# EAGLE design Skaarhoj BI8-SE-C30 (EAGLE 6.2)
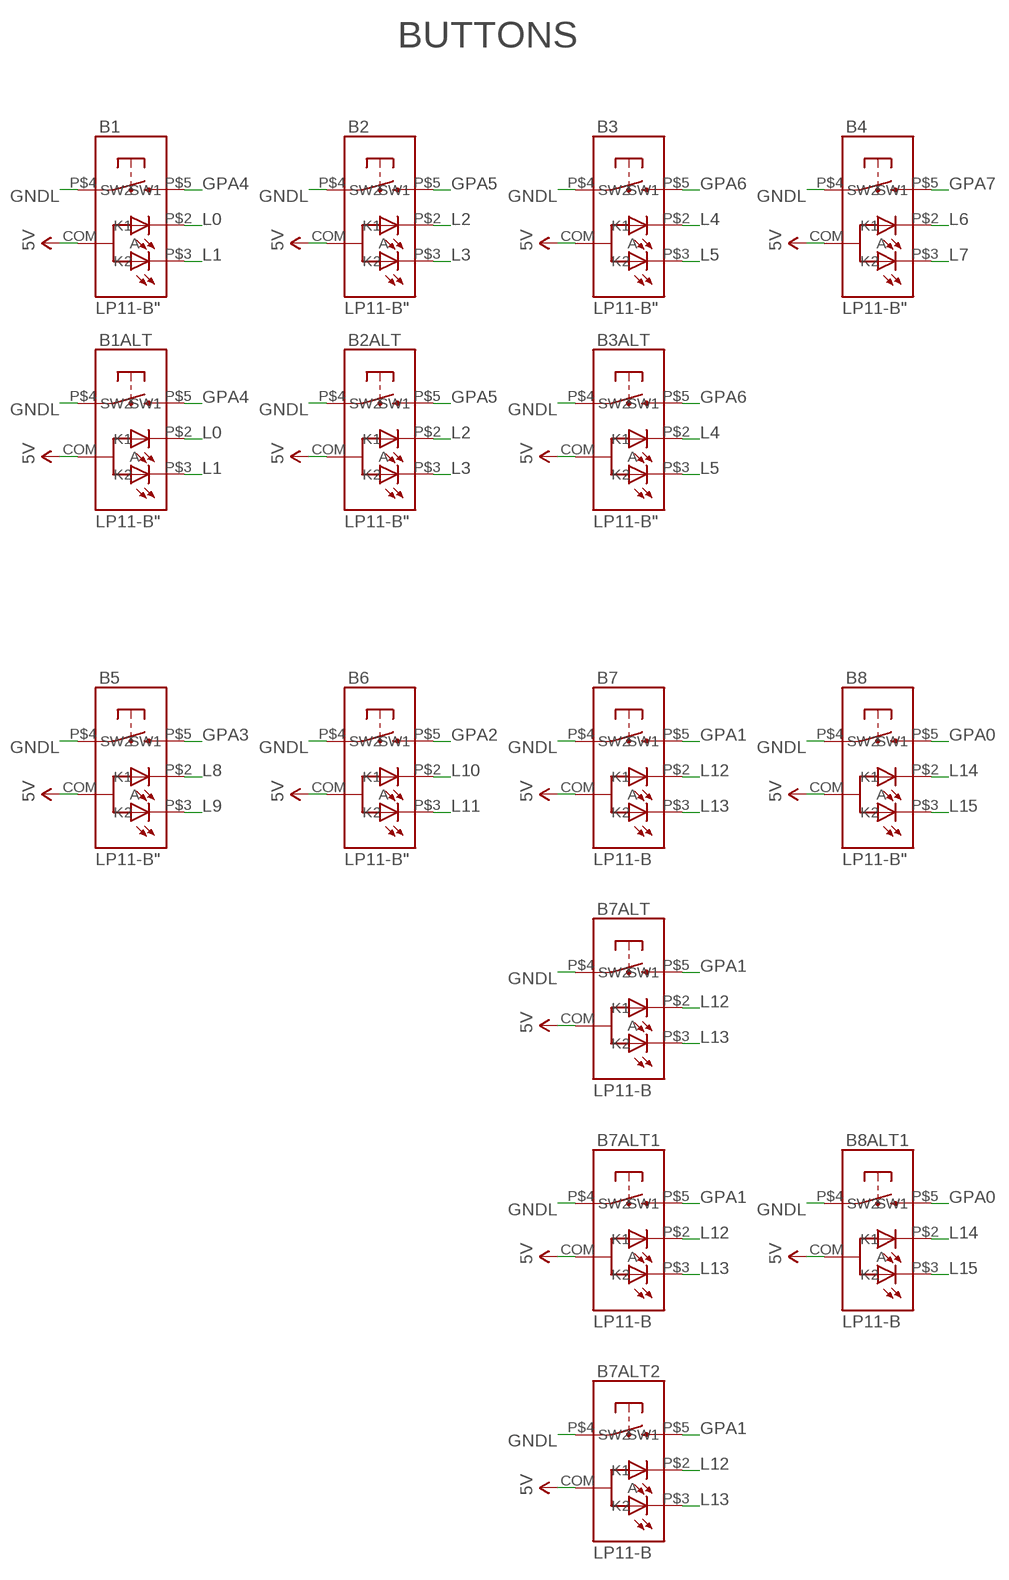
[diagram p0: schematic, sheet 1, part 1 of 2]
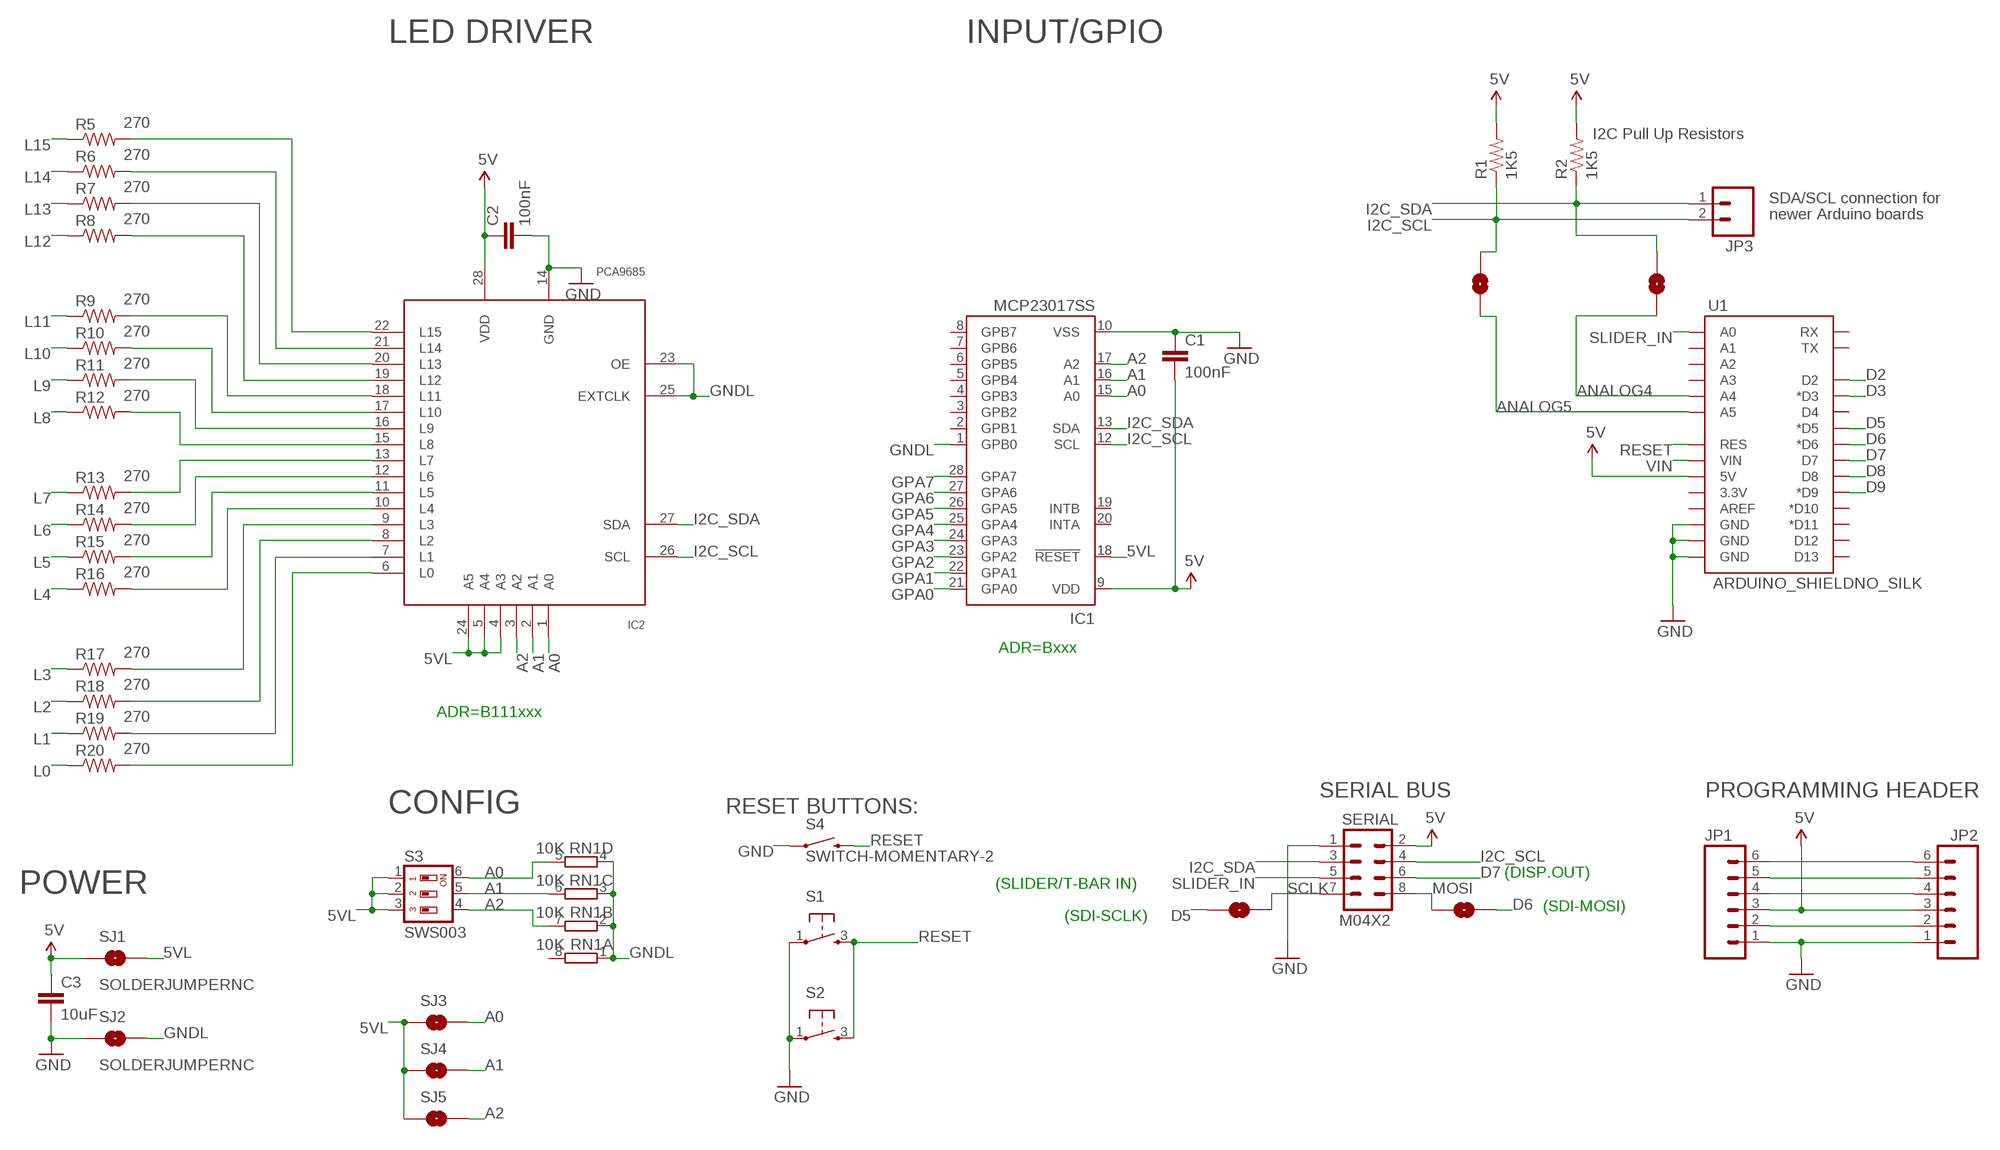
[diagram p1: schematic, sheet 1, part 2 of 2]

## Parts
B1  LP11-B"  [LP11]
B1ALT  LP11-B"  [LP11]
B2  LP11-B"  [LP11]
B2ALT  LP11-B"  [LP11]
B3  LP11-B"  [LP11]
B3ALT  LP11-B"  [LP11]
B4  LP11-B"  [LP11]
B5  LP11-B"  [LP11]
B6  LP11-B"  [LP11]
B7  LP11-B  [LP11_NOFIXHOLES]
B7ALT  LP11-B  [LP11_NOFIXHOLES]
B7ALT1  LP11-B  [LP11_NOFIXHOLES]
B7ALT2  LP11-B  [LP11_NOFIXHOLES]
B8  LP11-B"  [LP11]
B8ALT1  LP11-B  [LP11_NOFIXHOLES]
C1  100nF  CAP0603-CAP  [0603-CAP]
C2  100nF  CAP0603-CAP  [0603-CAP]
C3  10uF  CAP0805  [0805]
IC1  MCP23017SS  [SSOP28]
IC2  PCA9685  [TSSOP28]
JP1  M06POLAR  [MOLEX-1X6]
JP2  M06POLAR  [MOLEX-1X6]
JP3  M02PTH  [1X02]
MOSI->D6  SOLDERJUMPERNC  [SJ_2S]
R1  1K5  RESISTOR0603-RES  [0603-RES]
R2  1K5  RESISTOR0603-RES  [0603-RES]
R5  270  RESISTOR0603-RES  [0603-RES]
R6  270  RESISTOR0603-RES  [0603-RES]
R7  270  RESISTOR0603-RES  [0603-RES]
R8  270  RESISTOR0603-RES  [0603-RES]
R9  270  RESISTOR0603-RES  [0603-RES]
R10  270  RESISTOR0603-RES  [0603-RES]
R11  270  RESISTOR0603-RES  [0603-RES]
R12  270  RESISTOR0603-RES  [0603-RES]
R13  270  RESISTOR0603-RES  [0603-RES]
R14  270  RESISTOR0603-RES  [0603-RES]
R15  270  RESISTOR0603-RES  [0603-RES]
R16  270  RESISTOR0603-RES  [0603-RES]
R17  270  RESISTOR0603-RES  [0603-RES]
R18  270  RESISTOR0603-RES  [0603-RES]
R19  270  RESISTOR0603-RES  [0603-RES]
R20  270  RESISTOR0603-RES  [0603-RES]
RN1  10K  4R-NCAY16  [CAY16_HAND]
S1  TAC_SWITCH  [PUSHBUTTON]
S2  TAC_SWITCH  [PUSHBUTTON]
S3  SWS003  [SMS-003]
S3->A2  SOLDERJUMPERNC  [SJ_2S]
S3->A3  SOLDERJUMPERNC  [SJ_2S]
S4  SWITCH-MOMENTARY-2  [TACTILE_SWITCH_TALL]
SCLK->D5  SOLDERJUMPERNC  [SJ_2S]
SERIAL  M04X2  [2X4]
SJ1  SOLDERJUMPERNC  [SJ_2S]
SJ2  SOLDERJUMPERNC  [SJ_2S]
SJ3  SOLDERJUMPERNC  [SJ_2S]
SJ4  SOLDERJUMPERNC  [SJ_2S]
SJ5  SOLDERJUMPERNC  [SJ_2S]
U1  ARDUINO_SHIELDNO_SILK  [DUEMILANOVE_VIAS]

## Nets
5V [Power]: B1.COM(A) B1ALT.COM(A) B2.COM(A) B2ALT.COM(A) B3.COM(A) B3ALT.COM(A) B4.COM(A) B5.COM(A) B6.COM(A) B7.COM(A) B7ALT1.COM(A) B7ALT2.COM(A) B7ALT.COM(A) B8.COM(A) B8ALT1.COM(A) C1.2 C2.1 C3.1 IC1.9(VDD) IC2.28(VDD) JP1.3 JP2.3 R1.2 R2.2 SERIAL.2 SJ1.1 U1.5V
5VL: IC1.18(!RESET) IC2.4(A3) IC2.5(A4) IC2.24(A5) S3.1 S3.2 S3.3 SJ1.2 SJ3.1 SJ4.1 SJ5.1
A0: IC1.15(A0) IC2.1(A0) RN1.5 S3.6 SJ3.2
A1: IC1.16(A1) IC2.2(A1) RN1.6 S3.5 SJ4.2
A2: IC1.17(A2) IC2.3(A2) RN1.7 S3.4 SJ5.2
ANALOG4: S3->A3.2 U1.A4
ANALOG5: S3->A2.2 U1.A5
D2: U1.D2
D3: U1.D3(*D3)
D5: SCLK->D5.1 U1.D5(*D5)
D6: MOSI->D6.2 U1.D6(*D6)
D7: SERIAL.6 U1.D7
D8: U1.D8
D9: U1.D9(*D9)
GND [Power]: C1.1 C2.2 C3.2 IC1.10(VSS) IC2.14(GND) JP1.1 JP2.1 S1.1 S2.1 S4.A2 SERIAL.1 SJ2.1 U1.GND@0(GND) U1.GND@1(GND) U1.GND@2(GND)
GNDL: B1.P$4(SW1) B1ALT.P$4(SW1) B2.P$4(SW1) B2ALT.P$4(SW1) B3.P$4(SW1) B3ALT.P$4(SW1) B4.P$4(SW1) B5.P$4(SW1) B6.P$4(SW1) B7.P$4(SW1) B7ALT1.P$4(SW1) B7ALT2.P$4(SW1) B7ALT.P$4(SW1) B8.P$4(SW1) B8ALT1.P$4(SW1) IC1.1(GPB0) IC2.23(OE) IC2.25(EXTCLK) RN1.1 RN1.2 RN1.3 RN1.4 SJ2.2
GPA0: B8.P$5(SW2) B8ALT1.P$5(SW2) IC1.21(GPA0)
GPA1: B7.P$5(SW2) B7ALT1.P$5(SW2) B7ALT2.P$5(SW2) B7ALT.P$5(SW2) IC1.22(GPA1)
GPA2: B6.P$5(SW2) IC1.23(GPA2)
GPA3: B5.P$5(SW2) IC1.24(GPA3)
GPA4: B1.P$5(SW2) B1ALT.P$5(SW2) IC1.25(GPA4)
GPA5: B2.P$5(SW2) B2ALT.P$5(SW2) IC1.26(GPA5)
GPA6: B3.P$5(SW2) B3ALT.P$5(SW2) IC1.27(GPA6)
GPA7: B4.P$5(SW2) IC1.28(GPA7)
I2C_SCL: IC1.12(SCL) IC2.26(SCL) JP3.2 R1.1 S3->A2.1 SERIAL.4
I2C_SDA: IC1.13(SDA) IC2.27(SDA) JP3.1 R2.1 S3->A3.1 SERIAL.3
L0: B1.P$2(K1) B1ALT.P$2(K1) R20.1
L1: B1.P$3(K2) B1ALT.P$3(K2) R19.1
L2: B2.P$2(K1) B2ALT.P$2(K1) R18.1
L3: B2.P$3(K2) B2ALT.P$3(K2) R17.1
L4: B3.P$2(K1) B3ALT.P$2(K1) R16.1
L5: B3.P$3(K2) B3ALT.P$3(K2) R15.1
L6: B4.P$2(K1) R14.1
L7: B4.P$3(K2) R13.1
L8: B5.P$2(K1) R12.1
L9: B5.P$3(K2) R11.1
L10: B6.P$2(K1) R10.1
L11: B6.P$3(K2) R9.1
L12: B7.P$2(K1) B7ALT1.P$2(K1) B7ALT2.P$2(K1) B7ALT.P$2(K1) R8.1
L13: B7.P$3(K2) B7ALT1.P$3(K2) B7ALT2.P$3(K2) B7ALT.P$3(K2) R7.1
L14: B8.P$2(K1) B8ALT1.P$2(K1) R6.1
L15: B8.P$3(K2) B8ALT1.P$3(K2) R5.1
MOSI: MOSI->D6.1 SERIAL.8
N$1: JP1.2 JP2.2
N$4: IC2.13(L7) R13.2
N$5: IC2.12(L6) R14.2
N$7: IC2.11(L5) R15.2
N$9: IC2.10(L4) R16.2
N$10: IC2.9(L3) R17.2
N$11: IC2.8(L2) R18.2
N$12: IC2.7(L1) R19.2
N$19: IC2.6(L0) R20.2
N$20: IC2.15(L8) R12.2
N$21: IC2.16(L9) R11.2
N$22: IC2.17(L10) R10.2
N$23: IC2.18(L11) R9.2
N$24: IC2.19(L12) R8.2
N$25: IC2.20(L13) R7.2
N$26: IC2.21(L14) R6.2
N$27: IC2.22(L15) R5.2
N$33: JP1.4 JP2.4
N$34: JP1.5 JP2.5
N$45: JP1.6 JP2.6
RESET: S1.3 S2.3 S4.B2 U1.RES
SCLK: SCLK->D5.2 SERIAL.7
SLIDER_IN: SERIAL.5 U1.A0
VIN [Power]: U1.VIN
Unconnected: IC1.2(GPB1) IC1.3(GPB2) IC1.4(GPB3) IC1.5(GPB4) IC1.6(GPB5) IC1.7(GPB6) IC1.8(GPB7) IC1.19(INTB) IC1.20(INTA) RN1.8 U1.3.3V U1.A1 U1.A2 U1.A3 U1.AREF U1.D4 U1.D10(*D10) U1.D11(*D11) U1.D12 U1.D13 U1.RX U1.TX

## Notes on the sheet
- BUTTONS | LED DRIVER | INPUT/GPIO
- I2C Pull Up Resistors
- SDA/SCL connection for
- newer Arduino boards
- ADR=Bxxx
- ADR=B111xxx
- SERIAL BUS | PROGRAMMING HEADER
- CONFIG | RESET BUTTONS:
- (DISP.OUT)
- (SLIDER/T-BAR IN)
- POWER
- (SDI-MOSI)
- (SDI-SCLK)

## Library data of the parts
B1 B1ALT B2 B2ALT B3 B3ALT B4-B7 B7ALT B7ALT1 B7ALT2 B8 B8ALT1 = SKAARHOJ:LP11-B
C1-C3 = SparkFun:CAP: Capacitor Standard 0603 ceramic capacitor, and 0.1" leaded capacitor.
IC1 = microchip:MCP23017: http://ww1.microchip.com/downloads/en/DeviceDoc/21952a.pdf Source: http://ww1.microchip.com/downloads/en/DeviceDoc/21952a.pdf; MF: MICROCHIP; MPN: MCP23017-E/SS; OC_FARNELL: 1467674; OC_NEWARK: 31K2960
IC2 = wsmith:PCA9685
JP1 JP2 = SparkFun:M06: Header 6 Standard 6-pin 0.1" header. Use with straight break away headers (SKU : PRT-00116), right angle break away headers (PRT-00553), swiss pins (PRT-00743), machine pins (PRT-00117), and female headers (PRT-00115). Molex polarized connector foot print use with SKU : PRT-08094 with associated crimp pins and housings. NOTES ON THE VARIANTS LOCK and LOCK_LONGPADS... This footprint was designed to help hold the alignment of a through-hole component (i.e. 6-pin header) while soldering it into place. You may notice that each hole has been shifted either up or down by 0.005 of an inch from it's more standard position (which is a perfectly straight line). This slight alteration caused the pins (the squares in the middle) to touch the edges of the holes. Because they are alternating, it causes a "brace" to hold the component in place. 0.005 has proven to be the perfect amount of "off-center" position when using our standard breakaway headers. Although looks a little odd when you look at the bare footprint, once you have a header in there, the alteration is very hard to notice. Also, if you push a header all the way into place, it is covered up entirely on the bottom side. This idea of altering the position of holes to aid alignment will be further integrated into the Sparkfun Library for other footprints. It can help hold any component with 3 or more connection pins.
JP3 = SparkFun:M02: Header 2 Standard 2-pin 0.1" header. Use with straight break away headers (SKU : PRT-00116), right angle break away headers (PRT-00553), swiss pins (PRT-00743), machine pins (PRT-00117), and female headers (PRT-00115). Molex polarized connector foot print use with SKU : PRT-08233 with associated crimp pins and housings.
MOSI->D6 S3->A2 S3->A3 SCLK->D5 SJ1-SJ5 = SparkFun:SOLDERJUMPER: Solder Jumper Standard SMD solder jumper. Used to automate production. Two varients : Normally Open and Normally Closed are the same, but have different paste layers. NC will have a large amount of paste and should jumper during reflow.
R1 R2 R5-R20 = SparkFun:RESISTOR: Resistor Basic schematic elements and footprints for 0603, 1206, and PTH resistors.
RN1 = SKAARHOJ:4R-N: Array Chip Resistor Source: RS Component / Phycomp; OC_FARNELL: unknown; OC_NEWARK: unknown
S1 S2 = SKAARHOJ:TAC_SWITCH: Momentary Switch Button commonly used for reset or general input. Spark Fun Electronics SKU : COM-00097
S3 = smd-special:SWS003: SMD Dip Switch 3 pol.
S4 = SparkFun:SWITCH-MOMENTARY-2
SERIAL = SparkFun:M04X2
U1 = SparkFun:ARDUINO_SHIELD

## Net classes
0 default: width 0.203 mm, drill 0.406 mm, clearance 0.203 mm
1 Power: width 0.406 mm, drill 0.61 mm, clearance 0.203 mm

## Board
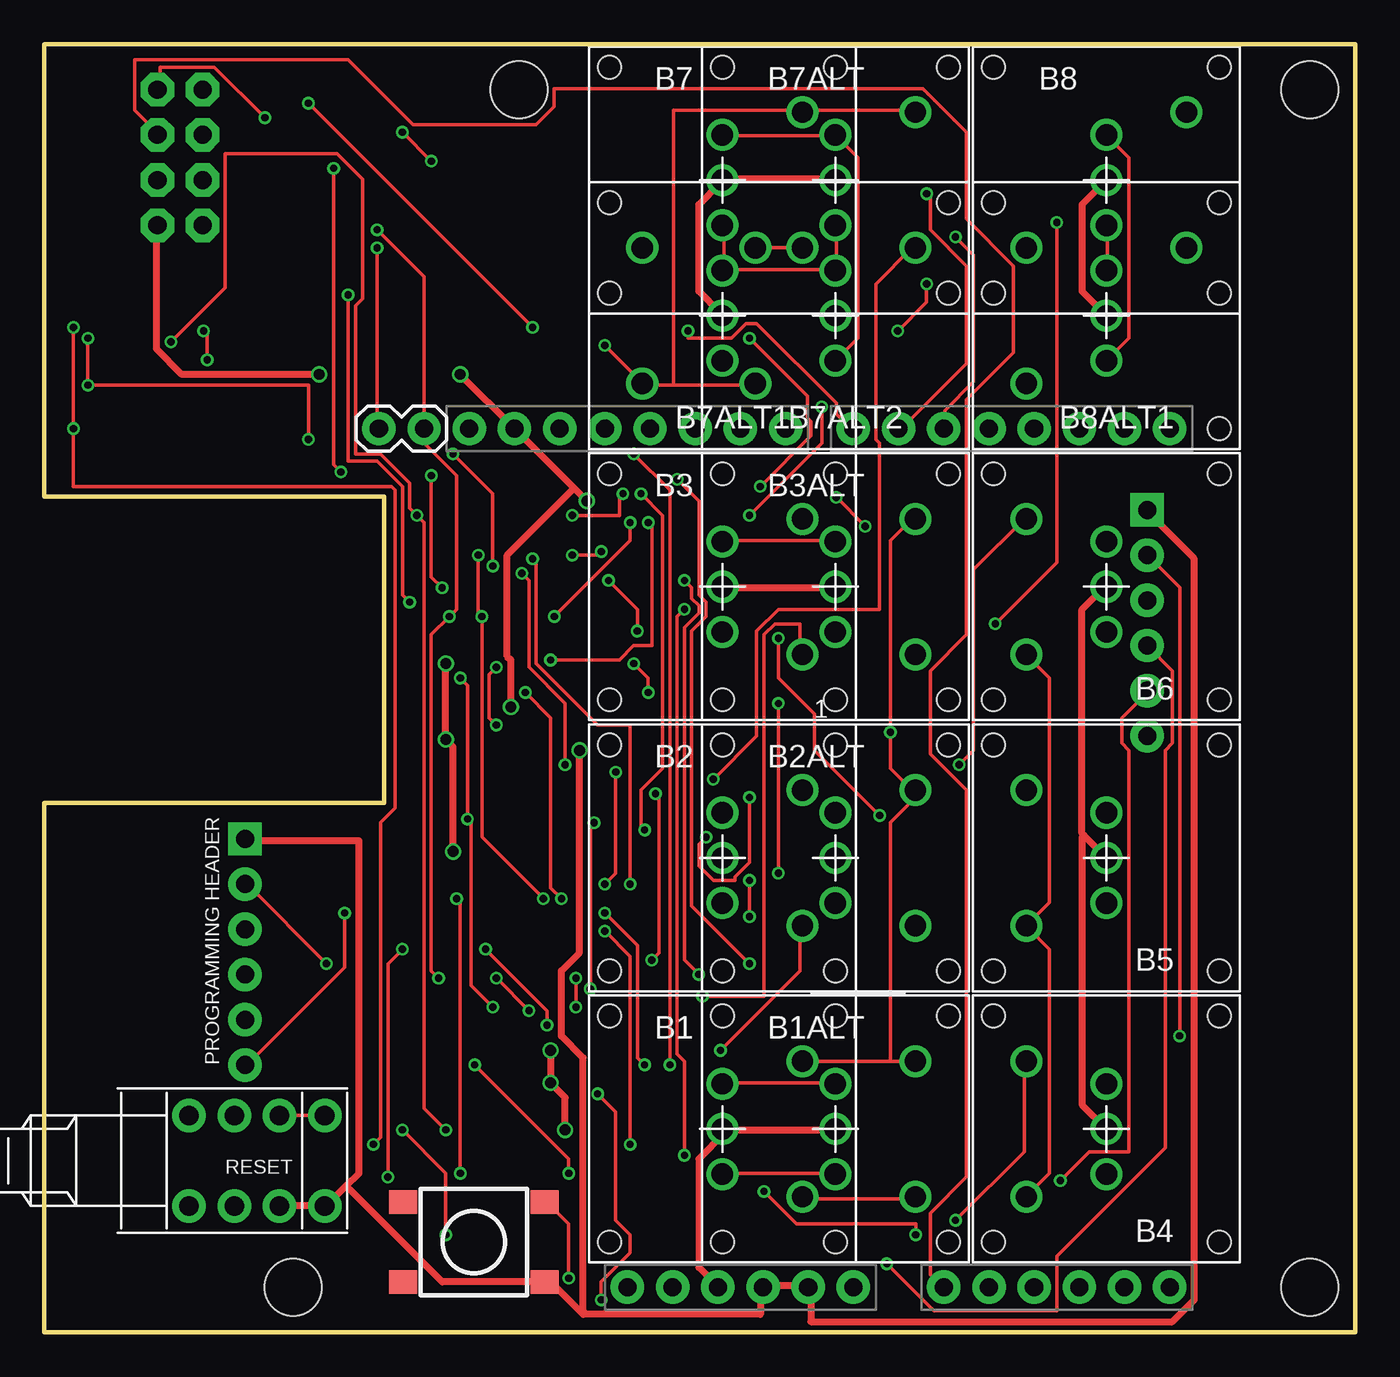
[diagram p2: board, top side]
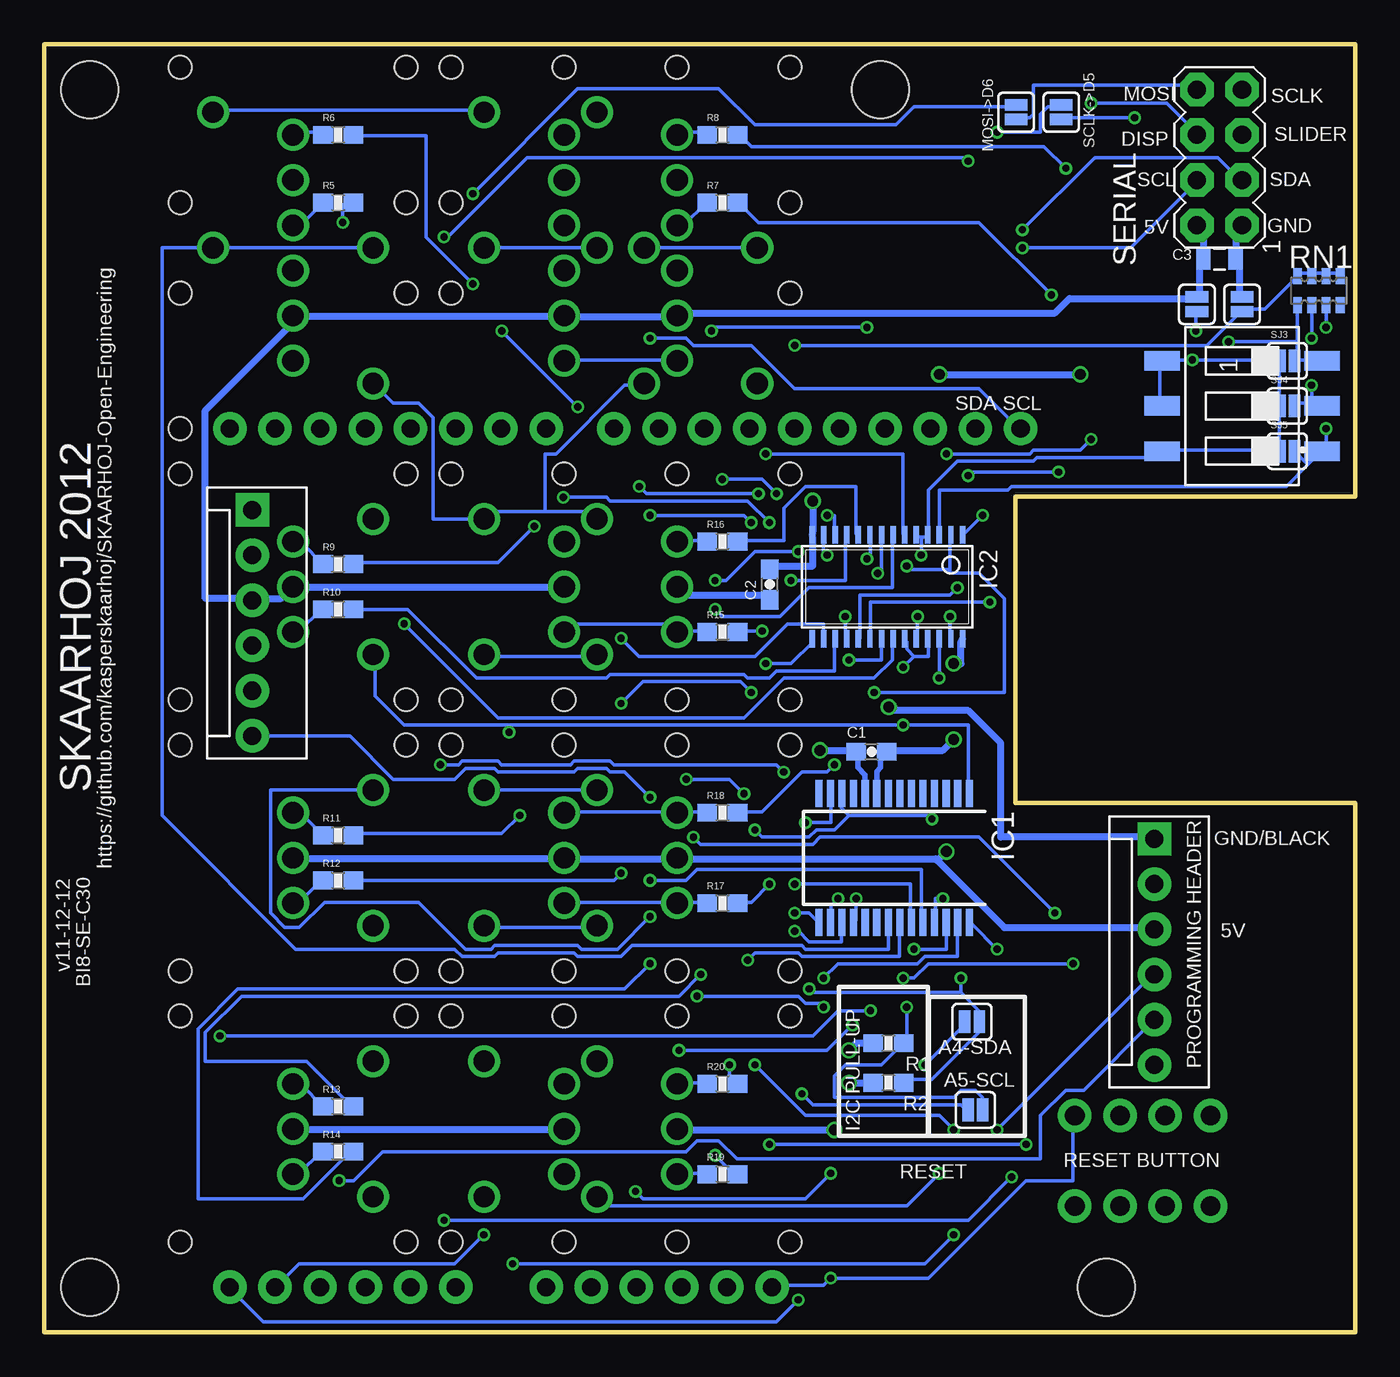
[diagram p3: board, bottom side, seen from below]

Size 73.66 x 72.39 mm. Coordinates in mm from the lower left corner, seen from the top.
Outline: 0,46.99 19.1,46.99 19.1,29.77 0,29.77 0,0 73.66,0 73.66,72.39 0,72.39 0,46.99
Copper layers (1*16): Top 0.035mm / dielectric 1.5mm / Bottom 0.035mm
Design rules: minimum track width 6mil, minimum drill 12mil, track to track 6mil, track to pad 6mil, pad to pad 6mil, via to via 6mil, smd to smd 0mil, copper to edge 10mil, drill to drill 10mil, minimum pad ring 10mil, minimum via ring 6mil, stop-mask expansion 2mil, vias tented up to drill 100mil, thermal gap 10mil
Holes 3.2 mm at 13.97,2.54 71.12,2.54 71.12,69.85 26.67,69.85
Holes 1.3 mm at 53.34,63.5 66.04,63.5 66.04,50.8 31.75,71.12 31.75,58.42 31.75,63.5 50.8,63.5 50.8,58.42 50.8,71.12 44.45,71.12 38.1,71.12
tRestrict: area 0,29.6 to 19.6,47.2
bRestrict: area 0,29.6 to 19.6,47.2

### Footprints (pad centres in the part's own frame; a part is rotated, then mirrored left to right if it is on the bottom)
LP11 = drill 1.2: COM 0,0; P$2 0,2.54; P$3 0,-2.54; P$4 4.5,3.81; P$5 4.5,-3.81 | hole 1.3: -6.35,6.35; 6.35,6.35; 6.35,-6.35; -6.35,-6.35
LP11_NOFIXHOLES = drill 1.2: COM 0,0; P$2 0,2.54; P$3 0,-2.54; P$4 4.5,3.81; P$5 4.5,-3.81
0603-CAP = smd 1.1 x 1: 1 -0.85,0; 2 0.85,0
0805 = smd 0.8 x 1.2: 1 -0.9,0; 2 0.9,0
SSOP28 = smd 0.4 x 1.5: 1 -4.225,-3.625; 2 -3.575,-3.625; 3 -2.925,-3.625; 4 -2.275,-3.625; 5 -1.625,-3.625; 6 -0.975,-3.625; 7 -0.325,-3.625; 8 0.325,-3.625; 9 0.975,-3.625; 10 1.625,-3.625; 11 2.275,-3.625; 12 2.925,-3.625; 13 3.575,-3.625; 14 4.225,-3.625; 15 4.225,3.625; 16 3.575,3.625; 17 2.925,3.625; 18 2.275,3.625; 19 1.625,3.625; 20 0.975,3.625; 21 0.325,3.625; 22 -0.325,3.625; 23 -0.975,3.625; 24 -1.625,3.625; 25 -2.275,3.625; 26 -2.925,3.625; 27 -3.575,3.625; 28 -4.225,3.625
TSSOP28 = smd 0.305 x 0.991: 1 -4.225,-2.918; 2 -3.575,-2.918; 3 -2.925,-2.918; 4 -2.275,-2.918; 5 -1.625,-2.918; 6 -0.975,-2.918; 7 -0.325,-2.918; 8 0.325,-2.918; 9 0.975,-2.918; 10 1.625,-2.918; 11 2.275,-2.918; 12 2.925,-2.918; 13 3.575,-2.918; 14 4.225,-2.918; 15 4.225,2.918; 16 3.575,2.918; 17 2.925,2.918; 18 2.275,2.918; 19 1.625,2.918; 20 0.975,2.918; 21 0.325,2.918; 22 -0.325,2.918; 23 -0.975,2.918; 24 -1.625,2.918; 25 -2.275,2.918; 26 -2.925,2.918; 27 -3.575,2.918; 28 -4.225,2.918
MOLEX-1X6 = drill 1.016 pad 1.88 square: 1 0,0 | drill 1.016 pad 1.88: 2 2.54,0; 3 5.08,0; 4 7.62,0; 5 10.16,0; 6 12.7,0
1X02 = drill 1.016 pad 1.88: 1 0,0; 2 2.54,0
SJ_2S = smd 0.635 x 1.27: 1 -0.412,0; 2 0.412,0
0603-RES = smd 1.1 x 1: 1 -0.85,0; 2 0.85,0
CAY16_HAND = smd 0.5 x 0.904: 1 -1.2,-0.813; 2 -0.4,-0.813; 3 0.4,-0.813; 4 1.2,-0.813; 5 1.2,0.813; 6 0.4,0.813; 7 -0.4,0.813; 8 -1.2,0.813
PUSHBUTTON = drill 1.1 pad 1.88: 1 2.54,2.54; 2 2.54,-2.54; 3 -2.54,2.54; 4 -2.54,-2.54
SMS-003 = smd 1.092 x 2.007: 1 -2.54,-4.496; 2 0,-4.496; 3 2.54,-4.496; 4 2.54,4.496; 5 0,4.496; 6 -2.54,4.496
TACTILE_SWITCH_TALL = smd 1.55 x 1.3: A1 -3.975,-2.25; A2 3.975,-2.25; B1 -3.975,2.25; B2 3.975,2.25
2X4 = drill 1.016 pad 1.88 octagon: 1 -3.81,-1.27; 2 -3.81,1.27; 3 -1.27,-1.27; 4 -1.27,1.27; 5 1.27,-1.27; 6 1.27,1.27; 7 3.81,-1.27; 8 3.81,1.27
DUEMILANOVE_VIAS = drill 1.016 pad 1.88: 3.3V 50.8,13.97; 5V 50.8,16.51; A0 50.8,29.21; A1 50.8,31.75; A2 50.8,34.29; A3 50.8,36.83; A4 50.8,39.37; A5 50.8,41.91; AREF 2.54,2.54; D2 2.54,36.83; D3 2.54,34.29; D4 2.54,31.75; D5 2.54,29.21; D6 2.54,26.67; D7 2.54,24.13; D8 2.54,20.32; D9 2.54,17.78; D10 2.54,15.24; D11 2.54,12.7; D12 2.54,10.16; D13 2.54,7.62; GND@0 50.8,19.05; GND@1 50.8,21.59; GND@2 2.54,5.08; RES 50.8,11.43; RX 2.54,41.91; TX 2.54,39.37; VIN 50.8,24.13

### Placement (x,y rotation side)
B1  38.1,11.43 0 top
B1ALT  44.45,11.43 0 top
B2  38.1,26.67 0 top
B2ALT  44.45,26.67 0 top
B3  38.1,41.91 0 top
B3ALT  44.45,41.91 0 top
B4  59.69,11.43 180 top
B5  59.69,26.67 180 top
B6  59.69,41.91 180 top
B7  38.1,64.77 0 top
B7ALT  44.45,64.77 0 top
B7ALT1  38.1,57.15 180 top
B7ALT2  44.45,57.15 180 top
B8  59.69,64.77 0 top
B8ALT1  59.69,57.15 180 top
C1  27.18,32.64 0 bottom
C2  32.89,42.04 90 bottom
C3  7.62,60.33 0 bottom
IC1  25.91,26.67 180 bottom
IC2  26.29,41.91 180 bottom
JP1  61.98,46.23 270 bottom
JP2  11.27,27.74 270 bottom
JP3  21.34,50.8 180 top
MOSI->D6  19.05,68.58 90 bottom
R1  26.23,16.26 180 bottom
R2  26.23,14.03 180 bottom
R5  57.15,63.5 0 bottom
R6  57.15,67.31 0 bottom
R7  35.56,63.5 0 bottom
R8  35.56,67.31 0 bottom
R9  57.15,43.18 0 bottom
R10  57.15,40.64 0 bottom
R11  57.15,27.94 0 bottom
R12  57.15,25.4 0 bottom
R13  57.15,12.7 0 bottom
R14  57.15,10.16 0 bottom
R15  35.56,39.37 0 bottom
R16  35.56,44.45 0 bottom
R17  35.56,24.13 0 bottom
R18  35.56,29.21 0 bottom
R19  35.56,8.89 0 bottom
R20  35.56,13.97 0 bottom
RN1  2.03,58.55 180 bottom
S1  13.21,9.65 270 top
S2  10.67,9.65 270 top
S3  6.35,52.07 270 bottom
S3->A2  21.34,12.51 180 bottom
S3->A3  21.53,17.46 180 bottom
S4  24.13,5.08 0 top
SCLK->D5  16.51,68.58 270 bottom
SERIAL  7.62,66.04 90 bottom
SJ1  8.89,57.78 270 bottom
SJ2  6.35,57.78 270 bottom
SJ3  3.81,54.61 0 bottom
SJ4  3.81,52.07 0 bottom
SJ5  3.81,49.53 0 bottom
U1  21.34,53.34 270 top

### Tracks (layer width: path | path; a pad name or v marks a point on that pad's centre or on a via)
5V  (via drill 0.61)
  Top 0.406: B8ALT1.COM 58.32,58.52 58.32,63.4 B8.COM | B7ALT.COM 44.3,64.82 38.2,64.82 B7.COM 38,64.62 36.78,63.4 36.78,58.52 38,57.3 B7ALT1.COM | v28.45,15.85 v28.45,14.02 29.26,13.21 v29.26,11.38 | B1ALT.COM 44.3,11.38 38.2,11.38 B1.COM 38.2,11.18 36.78,9.75 36.78,3.66 37.8,2.64 U1.5V | B3ALT.COM 44.3,41.86 38.2,41.86 B3.COM | v22.55,37.59 v22.55,33.33 22.96,32.92 v22.96,27.03 | B5.COM 58.42,27.94 | 58.42,27.94 58.32,28.04 58.32,40.64 59.54,41.86 B6.COM | B4.COM 58.32,12.8 58.32,27.84 58.42,27.94
  Bottom 0.305: IC1.9 26.88,31.54 26.67,31.75 26.67,32.3 C1.2
  Bottom 0.406: SERIAL.2 8.74,62.18 8.53,62.18 8.53,60.35 C3.1 8.53,60.15 8.74,60.15 8.74,58.32 SJ1.1 8.94,58.12 16.05,58.12 16.87,57.3 38,57.3 B7ALT1.COM 38.2,57.1 44.3,57.1 B7ALT2.COM 44.5,57.1 59.54,57.1 B8ALT1.COM 59.54,56.9 64.62,51.82 64.62,41.25 61.98,41.25 | v28.45,14.02 27.23,14.02 R2.2 | v28.45,15.85 28.04,16.26 R1.2 | v29.26,11.38 38,11.38 B1.COM | B4.COM 59.54,11.38 44.5,11.38 B1ALT.COM | 61.98,41.25 60.35,41.25 B6.COM 59.54,41.86 44.5,41.86 B3ALT.COM | C2.1 32.92,41.25 33.12,41.45 37.59,41.45 38,41.86 B3.COM | v22.55,37.59 22.15,37.59 22.15,38.81 IC2.28 | v22.55,33.33 23.16,32.72 26.21,32.72 C1.2 | B5.COM 59.54,26.62 44.5,26.62 B2ALT.COM 44.3,26.62 38.2,26.62 B2.COM 38,26.62 23.57,26.62 23.47,26.52 | 23.47,26.52 19.71,22.76 11.38,22.76 JP2.3 | 23.47,26.52 v22.96,27.03 | 61.98,41.25 JP1.3
5VL  (via drill 0.41)
  Top 0.203: v8.94,56.29 9.14,56.08 v9.14,54.66 | v24.38,43.69 24.38,40.44 v24.59,40.23 24.59,27.84 v28.04,24.38
  Bottom 0.203: v8.94,56.29 8.94,57.3 SJ1.2 | S3.2 10.97,52.22 10.97,54.46 S3.1 10.77,54.66 v9.14,54.66 4.27,54.66 SJ3.1 4.27,54.46 4.27,52.22 SJ4.1 4.27,52.02 4.27,49.58 | 4.27,49.58 10.77,49.58 S3.3 10.97,49.38 11.18,49.17 17.88,49.17 18.09,48.97 22.35,48.97 23.98,47.35 23.98,44.91 IC2.4 23.98,44.7 24.38,44.7 | 4.27,49.58 SJ5.1 | v24.59,40.23 24.59,39.01 IC2.24 | 24.38,44.7 v24.38,43.69 | 24.38,44.7 24.59,44.7 IC2.5 | v28.04,24.38 28.04,23.16 IC1.18
A0  (via drill 0.41)
  Top 0.203: v7.11,55.68 10.16,58.73 10.16,66.24 16.46,66.24 17.88,64.82 17.88,58.12 17.48,57.71 17.48,49.38 18.9,49.38 20.52,47.75 20.52,46.33 v20.93,45.92 21.34,45.52 21.34,12.6 v22.55,11.38 | v31.5,23.57 33.33,21.74 33.33,15.44 v33.73,15.04
  Bottom 0.203: 3.25,54.66 3.25,55.68 | 3.25,55.68 3.25,57.71 RN1.5 | v20.93,45.92 21.95,44.91 IC2.1 | 3.25,55.68 v7.11,55.68 | v31.5,23.57 30.68,23.57 30.28,23.16 IC1.15 | v33.73,15.04 30.89,12.19 23.37,12.19 v22.55,11.38 | 3.25,54.66 2.03,54.66 S3.6 | 3.25,54.66 SJ3.2
A1  (via drill 0.41)
  Top 0.203: v2.44,55.88 v2.44,53.24 14.83,53.24 v14.83,50.19 | v27.03,35.97 28.45,34.54 28.45,24.99 v29.06,24.38 | v22.96,49.38 25.2,47.14 v25.2,43.08
  Bottom 0.203: v2.44,55.88 2.44,57.71 RN1.6 | 2.44,52.22 v2.44,53.24 | 2.44,52.22 2.03,52.22 S3.5 2.44,52.22 | 2.44,52.22 3.25,52.22 SJ4.2 | 22.76,42.88 22.76,42.67 21.13,42.67 19.71,41.25 19.71,35.97 v27.03,35.97 | 22.76,42.88 22.76,44.7 IC2.2 | v29.06,24.38 29.46,23.98 29.46,23.16 IC1.16 | v14.83,50.19 15.44,49.58 18.09,49.58 18.29,49.38 v22.96,49.38 | v25.2,43.08 24.99,42.88 22.76,42.88
A2  (via drill 0.41)
  Top 0.203: v1.63,56.49 v1.63,50.8 1.63,47.55 19.51,47.55 19.71,47.35 19.71,29.46 18.9,28.65 18.9,10.97 v18.49,10.57 | v31.5,22.55 32.92,21.13 v32.92,10.57
  Bottom 0.203: v1.63,56.49 1.63,57.71 RN1.7 | v1.63,50.8 1.63,49.58 1.83,49.58 S3.4 2.03,49.38 2.64,48.77 | 2.64,48.77 3.86,47.55 19.3,47.55 19.51,47.35 23.37,47.35 23.37,44.91 IC2.3 | 2.64,48.77 3.25,49.38 SJ5.2 | v31.5,22.55 31.29,22.55 30.68,21.95 28.85,21.95 28.85,22.96 IC1.17 | v18.49,10.57 v32.92,10.57
ANALOG4  (via drill 0.41)
  Top 0.203: v24.18,15.04 29.46,9.75 v29.46,8.94 | v40.44,7.92 42.27,6.1 48.97,6.1 v48.97,5.49
  Bottom 0.203: v24.18,15.04 21.95,17.27 S3->A3.2 | v29.46,8.94 30.89,7.52 40.03,7.52 v40.44,7.92 | v48.97,5.49 50.6,3.86 59.33,3.86 60.55,2.64 U1.A4
ANALOG5  (via drill 0.41)
  Top 0.203: v31.09,13.41 32.11,12.39 32.11,6.3 32.92,5.49 32.92,4.47 31.29,2.85 v31.29,1.83
  Bottom 0.203: v31.09,13.41 30.48,12.8 22.15,12.8 21.95,12.6 S3->A2.2 | v31.29,1.83 32.51,0.61 61.37,0.61 63.2,2.44 U1.A5
D5  (via drill 0.41)
  Top 0.203: v21.74,65.84 v20.12,67.46 | v51.21,61.57 52.22,60.55 52.22,53.44 50.6,51.82 50.6,50.8 U1.D5
  Bottom 0.203: v20.12,67.46 17.68,67.46 17.68,68.48 17.27,68.89 16.66,68.89 SCLK->D5.1 | v21.74,65.84 21.95,66.04 46.53,66.04 51,61.57 v51.21,61.57
D6  (via drill 0.41)
  Top 0.203: v49.58,64.01 49.78,63.8 49.78,61.98 51.82,59.94 51.82,54.46 48.16,50.8 U1.D6
  Bottom 0.203: v49.58,64.01 43.69,69.9 35.76,69.9 33.73,67.87 25.81,67.87 24.79,68.89 19.1,68.89 MOSI->D6.2
D7  (via drill 0.41)
  Top 0.203: v36.17,56.29 36.17,55.88 38.61,55.88 39.42,56.69 40.03,56.69 44.5,52.22 44.5,51.61 45.31,50.8 U1.D7 | v14.83,69.09 v27.43,56.49
  Bottom 0.203: v36.17,56.29 35.97,56.49 v27.43,56.49 | v14.83,69.09 10.57,69.09 8.94,67.46 SERIAL.6
GND  (via drill 0.61)
  Top 0.406: 29.77,47.45 U1.GND@2 v23.37,53.85 | 29.77,47.45 v30.48,46.74 | v15.44,53.85 7.72,53.85 6.3,55.27 6.3,62.18 SERIAL.1 | S2.1 S1.1 15.85,7.11 16.97,8.23 | 16.97,8.23 17.68,8.94 17.68,27.64 11.38,27.64 JP2.1 | 30.18,1.12 30.28,1.02 40.23,1.02 40.23,2.44 U1.GND@0 40.44,2.64 42.88,2.64 U1.GND@1 43.08,2.44 43.08,0.61 63.4,0.61 64.62,1.83 64.62,43.48 61.98,46.13 JP1.1 | 30.18,1.12 28.65,2.64 28.25,2.64 S4.A2 28.04,2.85 22.35,2.85 16.97,8.23 | v30.07,32.72 30.07,21.34 29.06,20.32 29.06,16.66 30.28,15.44 30.28,1.22 30.18,1.12 | 29.77,47.45 26.01,43.69 26.01,38 26.21,37.8 v26.21,35.15
  Bottom 0.305: IC1.10 27.53,31.34 27.94,31.75 27.94,32.55 C1.1
  Bottom 0.406: SERIAL.1 6.5,62.18 6.71,62.18 6.71,60.35 C3.2 6.5,60.35 6.5,58.32 SJ2.1 | 30.48,44.91 IC2.14 | IC2.14 30.48,44.7 30.48,43.08 32.72,43.08 C2.2 | v30.48,46.74 30.48,45.11 IC2.14 | v23.37,53.85 v15.44,53.85 | v30.07,32.72 28.04,32.72 C1.1 | v26.21,35.15 26.01,34.95 21.74,34.95 19.91,33.12 19.91,27.84 11.38,27.84 JP2.1
GNDL  (via drill 0.41)
  Top 0.203: B4.P$4 55.27,7.72 56.49,8.94 56.49,21.54 55.27,22.76 B5.P$4 55.27,22.96 56.49,24.18 56.49,36.78 55.27,38 B6.P$4 | v25.4,37.39 24.99,36.98 24.99,34.54 v25.4,34.14 | B7ALT.P$4 48.77,68.68 42.67,68.68 B7.P$4 42.47,68.68 35.36,68.68 35.36,53.24 | B1ALT.P$4 47.55,15.24 | 47.55,15.24 B1.P$4 | 47.55,15.24 47.55,28.65 48.77,29.87 48.77,30.48 | v31.5,55.47 33.53,53.44 B7ALT1.P$4 33.73,53.24 35.36,53.24 | 35.36,53.24 39.83,53.24 B7ALT2.P$4 | 48.77,30.48 47.55,31.7 v47.55,33.73 47.55,44.5 48.77,45.72 B3ALT.P$4 | 48.77,30.48 B2ALT.P$4
  Bottom 0.203: 24.79,38 23.98,38 23.98,38.81 IC2.25 | 24.79,38 25.2,38.41 25.2,38.81 IC2.23 | 47.55,34.14 53.44,34.14 55.07,35.76 55.07,38 B6.P$4 | 47.55,34.14 v25.4,34.14 21.74,34.14 21.74,30.48 IC1.1 | v25.4,37.39 24.79,38 | B8.P$4 64.01,68.68 48.97,68.68 B7ALT.P$4 | B2ALT.P$4 B2.P$4 | 45.52,46.13 48.36,46.13 48.77,45.72 B3ALT.P$4 51.82,45.72 51.82,51.41 52.63,52.22 54.05,52.22 55.07,53.24 B8ALT1.P$4 | 45.52,46.13 43.08,46.13 42.67,45.72 B3.P$4 | RN1.1 1.02,59.54 1.63,59.54 RN1.2 1.83,59.54 2.23,59.54 RN1.3 2.44,59.54 3.05,59.54 RN1.4 3.25,59.33 5.08,57.51 6.3,57.51 SJ2.2 6.5,57.3 8.33,55.47 v31.5,55.47 | 45.52,46.13 45.52,49.38 44.91,49.38 41.05,53.24 40.03,53.24 B7ALT2.P$4 | v47.55,33.73 47.55,34.14
GPA0
  Bottom 0.203: IC1.21 26.21,22.96 26.21,21.54 30.89,21.54 31.09,21.74 40.64,21.74 41.25,21.13 43.69,21.13 43.89,21.34 48.16,21.34 48.36,21.13 50.19,21.13 50.6,21.54 59.54,21.54 67.06,29.06 67.06,60.96 B8.P$5 B8ALT1.P$5
GPA1  (via drill 0.41)
  Top 0.203: B7ALT2.P$5 B7.P$5 | v34.14,20.93 34.54,21.34 34.54,30.07 v34.34,30.28 | v37.59,31.09 40.03,33.53 40.03,39.42 41.25,40.64 46.94,40.64 46.94,49.99 46.74,50.19 46.74,58.93 48.77,60.96 B7ALT.P$5
  Bottom 0.203: B7ALT2.P$5 B7ALT1.P$5 | v34.14,20.93 33.73,21.34 31.29,21.34 31.09,21.13 25.6,21.13 25.6,22.96 IC1.22 | v34.34,30.28 35.15,31.09 v37.59,31.09 | B7ALT.P$5 B7.P$5
GPA2  (via drill 0.41)
  Top 0.203: v31.5,25.2 32.11,25.81 v32.11,31.5 | v51.41,31.9 52.22,32.72 52.22,42.88 55.07,45.72 B6.P$5
  Bottom 0.203: v31.5,25.2 24.99,25.2 24.99,23.16 IC1.23 | v32.11,31.5 32.51,31.9 41.66,31.9 41.86,32.11 43.89,32.11 44.09,31.9 47.95,31.9 48.16,32.11 50.19,32.11 50.39,31.9 v51.41,31.9
GPA3  (via drill 0.41)
  Top 0.203: v39.62,23.37 v39.62,25.4
  Bottom 0.203: v39.62,25.4 37.59,25.4 36.98,26.01 24.38,26.01 24.38,23.16 IC1.24 | v39.62,23.37 41.45,21.54 43.48,21.54 43.69,21.74 48.36,21.74 48.56,21.54 49.99,21.54 52.63,24.18 57.91,24.18 59.33,22.76 60.15,22.76 60.96,23.57 60.96,30.48 B5.P$5
GPA4  (via drill 0.41)
  Top 0.203: v23.16,24.38 23.37,24.18 v23.37,8.94 | B1ALT.P$5 48.77,7.52 42.67,7.52 B1.P$5
  Bottom 0.203: v23.16,24.38 23.57,24.38 23.57,23.16 IC1.25 | v23.37,8.94 25.2,7.11 42.06,7.11 42.47,7.52 B1.P$5
GPA5  (via drill 0.41)
  Top 0.203: v24.79,21.54 28.25,18.09 v28.25,17.27 | v38,15.85 42.47,20.32 42.47,22.76 B2.P$5
  Bottom 0.203: v24.79,21.54 22.96,21.54 22.96,22.96 IC1.26 | v28.25,17.27 29.67,15.85 v38,15.85 | B2ALT.P$5 48.77,22.76 42.67,22.76 B2.P$5
GPA6  (via drill 0.41)
  Top 0.203: v29.87,18.29 v29.87,19.91 | v36.98,18.9 40.44,18.9 40.44,39.22 41.05,39.83 42.47,39.83 42.47,38.2 B3.P$5
  Bottom 0.203: v29.87,19.91 29.06,20.73 24.59,20.73 24.18,21.13 22.35,21.13 22.35,22.96 IC1.27 | v29.87,18.29 30.07,18.49 30.89,18.49 31.29,18.9 v36.98,18.9 | B3ALT.P$5 48.77,38 42.67,38 B3.P$5
GPA7  (via drill 0.41)
  Top 0.203: v20.12,21.54 19.3,20.73 v19.3,8.74 | v51.21,6.3 55.07,10.16 55.07,15.24 B4.P$5
  Bottom 0.203: v20.12,21.54 21.54,22.96 IC1.28 | v19.3,8.74 21.74,6.3 v51.21,6.3
I2C_SCL  (via drill 0.41)
  Top 0.203: v18.69,60.96 18.69,50.8 JP3.2 | v23.37,36.78 23.77,36.37 v23.77,28.85 23.98,28.65 23.98,19.51 v25.2,18.29 | v39.62,55.88 42.88,52.63 42.88,51.41 43.08,51.21 43.08,50.39 v40.23,47.55 | v33.53,47.14 34.75,45.92 34.75,31.7 33.53,30.48 33.53,28.45 v33.73,28.25
  Bottom 0.203: v18.69,60.96 12.6,60.96 8.94,64.62 SERIAL.4 | S3->A2.1 20.93,12.6 20.93,13.21 21.34,13.61 22.15,13.61 22.55,13.21 29.26,13.21 29.26,14.43 28.65,15.04 26.62,15.04 25.4,16.26 R1.1 25.2,16.26 v25.2,18.29 | v23.37,36.78 23.37,38.81 IC2.26 | v23.77,28.85 23.98,29.06 28.45,29.06 | 28.45,29.06 28.85,29.46 28.85,30.28 IC1.12 | v39.62,55.88 37.59,55.88 37.19,55.47 33.93,55.47 31.5,53.03 21.13,53.03 18.9,50.8 JP3.2 | v40.23,47.55 39.83,47.14 v33.53,47.14 | v33.73,28.25 33.33,27.84 30.68,27.84 30.28,28.25 29.26,28.25 28.45,29.06
I2C_SDA  (via drill 0.41)
  Top 0.203: v30.89,28.65 30.68,28.45 v30.68,19.3 | v18.69,61.98 21.34,59.33 JP3.1 21.34,49.99 23.16,48.16 23.16,40.64 v22.76,40.23 21.74,39.22 21.74,20.32 v22.15,19.91
  Bottom 0.203: R2.1 25.2,14.22 23.77,14.22 21.13,16.87 21.13,17.27 S3->A3.1 21.13,17.48 21.13,18.09 22.15,19.1 | v30.89,28.65 29.46,28.65 29.46,30.28 IC1.13 | v30.68,19.3 30.48,19.1 22.15,19.1 | v22.76,40.23 22.76,39.01 IC2.27 | v18.69,61.98 14.63,66.04 7.72,66.04 6.5,64.82 SERIAL.3 | v22.15,19.91 22.15,19.1
L0
  Top 0.203: B1.P$2 38.2,14.02 44.3,14.02 B1ALT.P$2
  Bottom 0.203: R20.1 36.58,14.02 38,14.02 B1.P$2
L1
  Top 0.203: B1.P$3 38.2,8.94 44.3,8.94 B1ALT.P$3
  Bottom 0.203: R19.1 36.58,8.94 38,8.94 B1.P$3
L2
  Bottom 0.203: R18.1 36.58,29.26 38,29.26 B2.P$2 38.2,29.26 44.3,29.26 B2ALT.P$2
L3
  Bottom 0.203: R17.1 36.58,24.18 38,24.18 B2.P$3 38.2,24.18 44.3,24.18 B2ALT.P$3
L4
  Top 0.203: B3.P$2 38.2,44.5 44.3,44.5 B3ALT.P$2
  Bottom 0.203: R16.1 36.58,44.5 38,44.5 B3.P$2
L5
  Bottom 0.203: R15.1 36.58,39.42 38,39.42 B3.P$3 38.2,39.42 38.61,39.83 43.89,39.83 44.3,39.42 B3ALT.P$3
L6
  Bottom 0.203: R14.1 58.12,10.16 59.33,8.94 59.54,8.94 B4.P$2
L7
  Bottom 0.203: R13.1 58.12,12.8 59.13,13.82 59.54,13.82 B4.P$3
L8
  Bottom 0.203: R12.1 58.12,25.4 59.33,24.18 59.54,24.18 B5.P$2
L9
  Bottom 0.203: R11.1 58.12,28.04 59.13,29.06 59.54,29.06 B5.P$3
L10
  Bottom 0.203: R10.1 58.12,40.64 59.33,39.42 59.54,39.42 B6.P$2
L11
  Bottom 0.203: R9.1 58.12,43.28 59.13,44.3 59.54,44.3 B6.P$3
L12
  Top 0.203: B7.P$2 38.2,67.26 44.3,67.26 B7ALT.P$2 45.72,66.04 45.72,55.88 B7ALT2.P$2
  Bottom 0.203: B7ALT1.P$2 38.2,54.66 44.3,54.66 B7ALT2.P$2 | R8.1 36.58,67.46 38,67.46 B7.P$2
L13
  Top 0.203: 38.2,59.74 38.2,62.18 B7.P$3 | B7ALT.P$3 44.5,62.18 44.5,59.74 B7ALT2.P$3 44.3,59.74 38.2,59.74 | 38.2,59.74 B7ALT1.P$3
  Bottom 0.203: R7.1 36.58,63.4 37.59,62.38 38,62.38 B7.P$3
L14
  Top 0.203: B8ALT1.P$2 60.96,55.88 60.96,66.04 B8.P$2
  Bottom 0.203: R6.1 58.12,67.46 59.54,67.46 B8.P$2
L15
  Top 0.203: B8ALT1.P$3 59.74,59.74 59.74,62.18 B8.P$3
  Bottom 0.203: R5.1 58.12,63.4 59.13,62.38 59.54,62.38 B8.P$3
MOSI
  Bottom 0.203: SERIAL.8 9.14,70.1 18.09,70.1 18.09,68.48 18.29,68.28 18.9,68.28 MOSI->D6.1
N$1  (via drill 0.41)
  Top 0.203: v15.85,20.73 11.38,25.2 JP2.2 | v27.23,18.09 v25.4,19.91 | v63.8,16.66 63.8,41.86 JP1.2
  Bottom 0.203: v15.85,20.73 23.98,20.73 24.79,19.91 v25.4,19.91 | v27.23,18.09 29.06,18.09 30.48,16.66 v63.8,16.66
N$4  (via drill 0.41)
  Top 0.203: v29.67,43.69 31.29,43.69 v31.29,43.89 | v35.97,42.27 36.37,41.86 36.37,41.25 36.78,40.84 36.78,40.44 35.97,39.62 35.97,20.93 v36.78,20.12
  Bottom 0.203: v29.67,43.69 29.87,43.69 29.87,44.7 IC2.13 | v31.29,43.89 33.73,43.89 35.36,42.27 v35.97,42.27 | v36.78,20.12 38,18.9 62.59,18.9 64.62,16.87 64.62,15.24 58.93,15.24 56.49,12.8 R13.2
N$5  (via drill 0.41)
  Top 0.203: v29.67,45.92 32.31,45.92 32.31,46.94 v32.51,47.14 | v35.56,47.95 36.78,46.74 36.78,41.45 37.19,41.05 37.19,40.23 36.37,39.42 36.37,23.98 v39.62,20.73
  Bottom 0.203: v29.67,45.92 29.26,45.92 29.26,44.91 IC2.12 | v32.51,47.14 33.33,47.95 v35.56,47.95 | v39.62,20.73 41.05,19.3 62.79,19.3 65.02,17.07 65.02,7.52 59.13,7.52 56.49,10.16 R14.2
N$7  (via drill 0.41)
  Top 0.203: v31.7,42.27 33.33,40.64 v33.33,39.42
  Bottom 0.203: v31.7,42.27 28.65,42.27 28.65,44.7 IC2.11 | v33.33,39.42 34.54,39.42 R15.2
N$9
  Bottom 0.203: IC2.10 28.04,44.91 28.04,47.55 30.89,47.55 32.11,46.33 32.11,44.5 34.54,44.5 R16.2
N$10  (via drill 0.41)
  Top 0.203: v27.43,43.48 27.64,43.28 27.64,37.59 31.09,34.14 32.92,34.14 v32.92,25.2
  Bottom 0.203: v27.43,43.48 27.23,43.48 27.23,44.7 IC2.9 | v32.92,25.2 33.93,24.18 34.54,24.18 R17.2
N$11  (via drill 0.41)
  Top 0.203: v26.82,42.67 27.23,42.27 27.23,37.39 29.26,35.36 v29.26,31.9
  Bottom 0.203: v26.82,42.67 26.62,42.67 26.62,44.7 IC2.8 | v29.26,31.9 29.67,31.5 31.09,31.5 33.33,29.26 34.54,29.26 R18.2
N$12  (via drill 0.41)
  Top 0.203: v35.97,40.64 35.56,40.23 35.56,15.65 35.97,15.24 v35.97,9.96
  Bottom 0.203: v35.97,40.64 35.56,40.23 32.31,40.23 30.68,41.86 26.01,41.86 26.01,44.7 IC2.7 | v35.97,9.96 34.95,8.94 34.75,8.94 R19.2
N$19  (via drill 0.41)
  Top 0.203: v33.12,49.38 35.15,47.35 v35.15,15.04
  Bottom 0.203: v33.12,49.38 25.4,49.38 25.4,44.91 IC2.6 | v35.15,15.04 35.15,14.02 34.75,14.02 R20.2
N$20  (via drill 0.41)
  Top 0.203: v33.12,37.59 33.93,36.78 v33.93,35.97 | v41.25,25.81 v41.25,35.36
  Bottom 0.203: v33.12,37.59 31.7,37.59 30.48,38.81 IC2.15 | v33.93,35.97 34.54,36.58 40.03,36.58 v41.25,35.36 | v41.25,25.81 41.66,25.4 R12.2
N$21  (via drill 0.41)
  Top 0.203: v41.25,39.01 41.25,36.78 43.28,34.75 43.28,32.72 v46.94,29.06
  Bottom 0.203: v41.25,39.01 40.23,38 33.73,38 31.9,39.83 29.87,39.83 29.87,39.01 IC2.16 | v46.94,29.06 47.95,28.04 56.29,28.04 R11.2
N$22
  Bottom 0.203: R10.2 53.24,40.64 49.38,36.78 42.06,36.78 41.86,36.98 34.34,36.98 34.14,36.78 32.92,36.78 32.51,37.19 29.26,37.19 29.26,38.81 IC2.17
N$23  (via drill 0.41)
  Top 0.203: v28.65,40.23 32.92,44.5 v32.92,45.52 | v46.13,45.31 v44.5,46.94
  Bottom 0.203: v28.65,40.23 28.65,39.01 IC2.18 | v32.92,45.52 34.14,46.74 41.86,46.74 42.06,46.94 v44.5,46.94 | v46.13,45.31 48.16,43.28 56.29,43.28 R9.2
N$24  (via drill 0.41)
  Top 0.203: v22.35,41.86 21.74,42.47 v21.74,48.16 | v16.66,48.36 16.26,48.77 v16.26,65.43
  Bottom 0.203: v22.35,41.86 22.76,41.45 27.84,41.45 27.84,39.01 IC2.19 | v21.74,48.16 21.54,48.36 v16.66,48.36 | v16.26,65.43 17.48,66.65 33.93,66.65 34.54,67.26 R8.2
N$25  (via drill 0.41)
  Top 0.203: v20.52,41.05 20.12,41.45 20.12,47.55 18.69,48.97 17.07,48.97 v17.07,58.32
  Bottom 0.203: v20.52,41.05 27.23,41.05 27.23,39.01 IC2.20 | v17.07,58.32 21.13,62.38 33.53,62.38 34.54,63.4 R7.2
N$26  (via drill 0.41)
  Top 0.203: v28.45,37.8 32.31,37.8 33.12,38.61 34.14,38.61 34.14,45.31 v33.93,45.52 | v39.62,45.92 43.69,49.99 v43.69,52.02 | v47.95,56.29 49.58,57.91 v49.58,58.93
  Bottom 0.203: v28.45,37.8 26.62,37.8 26.62,38.81 IC2.21 | v33.93,45.52 34.34,45.92 v39.62,45.92 | v47.95,56.29 v43.69,52.02 | v49.58,58.93 52.22,61.57 52.22,67.26 56.29,67.26 R6.2
N$27  (via drill 0.41)
  Top 0.203: v53.44,39.83 56.9,43.28 v56.9,62.38
  Bottom 0.203: v53.44,39.83 48.16,34.54 34.34,34.54 32.11,36.78 27.03,36.78 26.01,37.8 26.01,38.81 IC2.22 | v56.9,62.38 56.9,63.4 56.49,63.4 R5.2
N$33  (via drill 0.41)
  Top 0.203: v20.12,11.38 22.55,8.94 v22.55,5.49 | v47.35,3.86 49.99,1.22 56.9,1.22 56.9,4.27 62.99,10.36 62.99,32.72 63.4,33.12 63.4,37.19 JP1.4
  Bottom 0.203: v20.12,11.38 11.38,20.12 JP2.4 | v22.55,5.49 24.18,3.86 v47.35,3.86
N$34  (via drill 0.41)
  Top 0.203: v57.1,8.53 58.73,10.16 60.96,10.16 60.96,32.72 60.55,33.12 60.55,34.54 61.98,35.97 JP1.5
  Bottom 0.203: v57.1,8.53 56.29,8.53 54.66,10.16 37.59,10.16 36.98,10.77 35.76,10.77 34.75,9.75 17.68,9.75 17.68,12.19 16.26,13.61 15.24,13.61 11.38,17.48 JP2.5
N$45  (via drill 0.41)
  Top 0.203: v16.87,23.57 16.87,20.52 11.38,15.04 JP2.6 | v37.19,27.84 36.78,27.43 36.78,26.21 37.59,25.4 38.81,25.4 38.81,25.6 39.62,26.42 v39.62,30.07
  Bottom 0.203: v16.87,23.57 21.13,27.84 30.07,27.84 30.48,27.43 36.78,27.43 v37.19,27.84 | v39.62,30.07 41.05,31.5 41.86,31.5 42.06,31.7 43.69,31.7 43.89,31.5 48.16,31.5 48.36,31.7 49.99,31.7 50.6,31.09 54.05,31.09 56.49,33.53 JP1.6
RESET  (via drill 0.41)
  Top 0.203: S1.3 S2.3 | v29.46,3.05 29.46,6.1 28.25,7.32 S4.B2
  Bottom 0.203: U1.RES 32.72,2.64 29.87,2.64 v29.46,3.05 23.98,3.05 18.49,8.53 15.85,8.53 15.85,12.19 S1.3
SCLK  (via drill 0.41)
  Top 0.203: v12.39,68.28 9.55,71.12 6.5,71.12 6.5,69.9 SERIAL.7
  Bottom 0.203: v12.39,68.28 16.46,68.28 SCLK->D5.2
SLIDER_IN
  Top 0.203: U1.A0 50.39,2.64 49.78,3.25 49.78,6.71 51.82,8.74 51.82,30.48 49.78,32.51 49.78,37.19 51.82,39.22 51.82,52.43 54.46,55.07 54.46,59.94 51.82,62.59 51.82,67.46 49.38,69.9 28.65,69.9 28.65,68.89 27.64,67.87 20.73,67.87 17.07,71.53 5.08,71.53 5.08,68.68 6.3,67.46 SERIAL.5

### Text on the board
_tsilk: 1 | PROGRAMMING HEADER | RESET
_bsilk: SCLK | MOSI | SLIDER | DISP | SDA | SCL | GND | 5V | 1 | https://github.com/kasperskaarhoj/SKAARHOJ-Open-Engineering | SCL | SDA | SKAARHOJ 2012 | GND/BLACK | BI8-SE-C30 | v11-12-12 | 5V | A4-SDA | PROGRAMMING HEADER | A5-SCL | I2C PULL-UP | RESET BUTTON | RESET